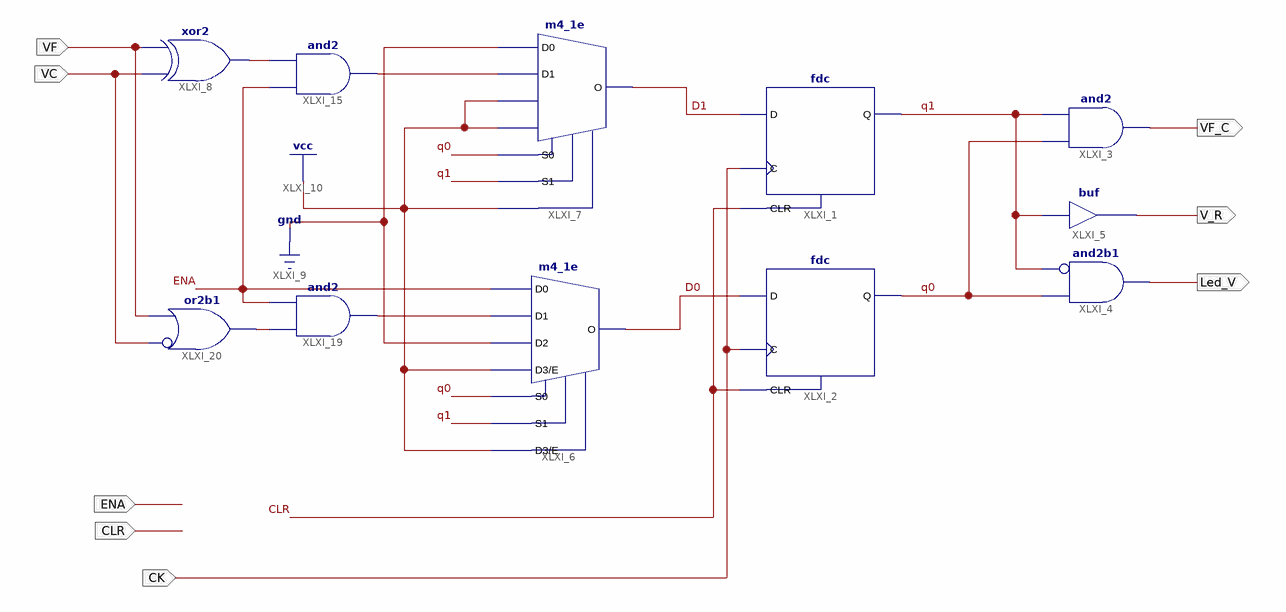
[diagram p0: schematic sheet 1]
// Xilinx ISE schematic Reg_Vot.sch (spartan6) as structural Verilog: 11 symbols, 8 ports
module Reg_Vot (
  input  ENA,
  input  VC,
  input  VF,
  input  CK,
  input  CLR,
  output VF_C,
  output V_R,
  output Led_V
);

  wire D0, D1, q0, q1, XLXN_30, XLXN_34, XLXN_45, XLXN_47;

  fdc XLXI_1 (.C(CK), .CLR(CLR), .D(D1), .Q(q1));
  fdc XLXI_2 (.C(CK), .CLR(CLR), .D(D0), .Q(q0));
  and XLXI_3 (VF_C, q0, q1);
  and XLXI_4 (Led_V, ~q1, q0);  // and2b1
  buf XLXI_5 (V_R, q1);
  m4_1e XLXI_6 (.D0(ENA), .D1(XLXN_45), .D2(1'b0), .D3(1'b1), .E(1'b1), .S0(q0), .S1(q1), .O(D0));
  m4_1e XLXI_7 (.D0(1'b0), .D1(XLXN_34), .D2(1'b1), .D3(1'b1), .E(1'b1), .S0(q0), .S1(q1), .O(D1));
  and XLXI_15 (XLXN_34, ENA, XLXN_30);
  xor XLXI_8 (XLXN_30, VC, VF);
  and XLXI_19 (XLXN_45, XLXN_47, ENA);
  or XLXI_20 (XLXN_47, ~VC, VF);  // or2b1
endmodule
